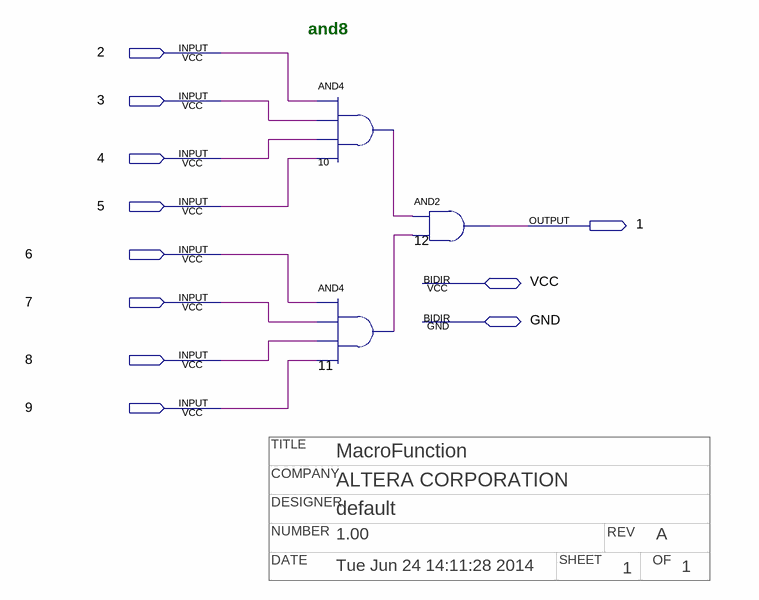
[diagram p0: schematic sheet]
// Quartus schematic npand8.bdf as structural Verilog: 3 symbols, 11 pins
// Title block: TITLE: MacroFunction; COMPANY: ALTERA CORPORATION; DESIGNER: default; NUMBER: 1.00; REV: A; DATE: Tue Jun 24 14:11:28 2014; SHEET: 1; OF: 1
module npand8 (
  input  \2 ,
  input  \3 ,
  input  \4 ,
  input  \5 ,
  input  \6 ,
  input  \7 ,
  input  \8 ,
  input  \9 ,
  inout  VCC,
  inout  GND,
  output \1 
);

  wire n10_out, n11_out;

  and u_10 (n10_out, \2 , \3 , \4 , \5 );
  and u_11 (n11_out, \6 , \7 , \8 , \9 );
  and u_12 (\1 , n10_out, n11_out);

  // Notes on the sheet:
  //   and8
endmodule
